# EAGLE schematic Buddy_PCB (EAGLE 7.5.0)
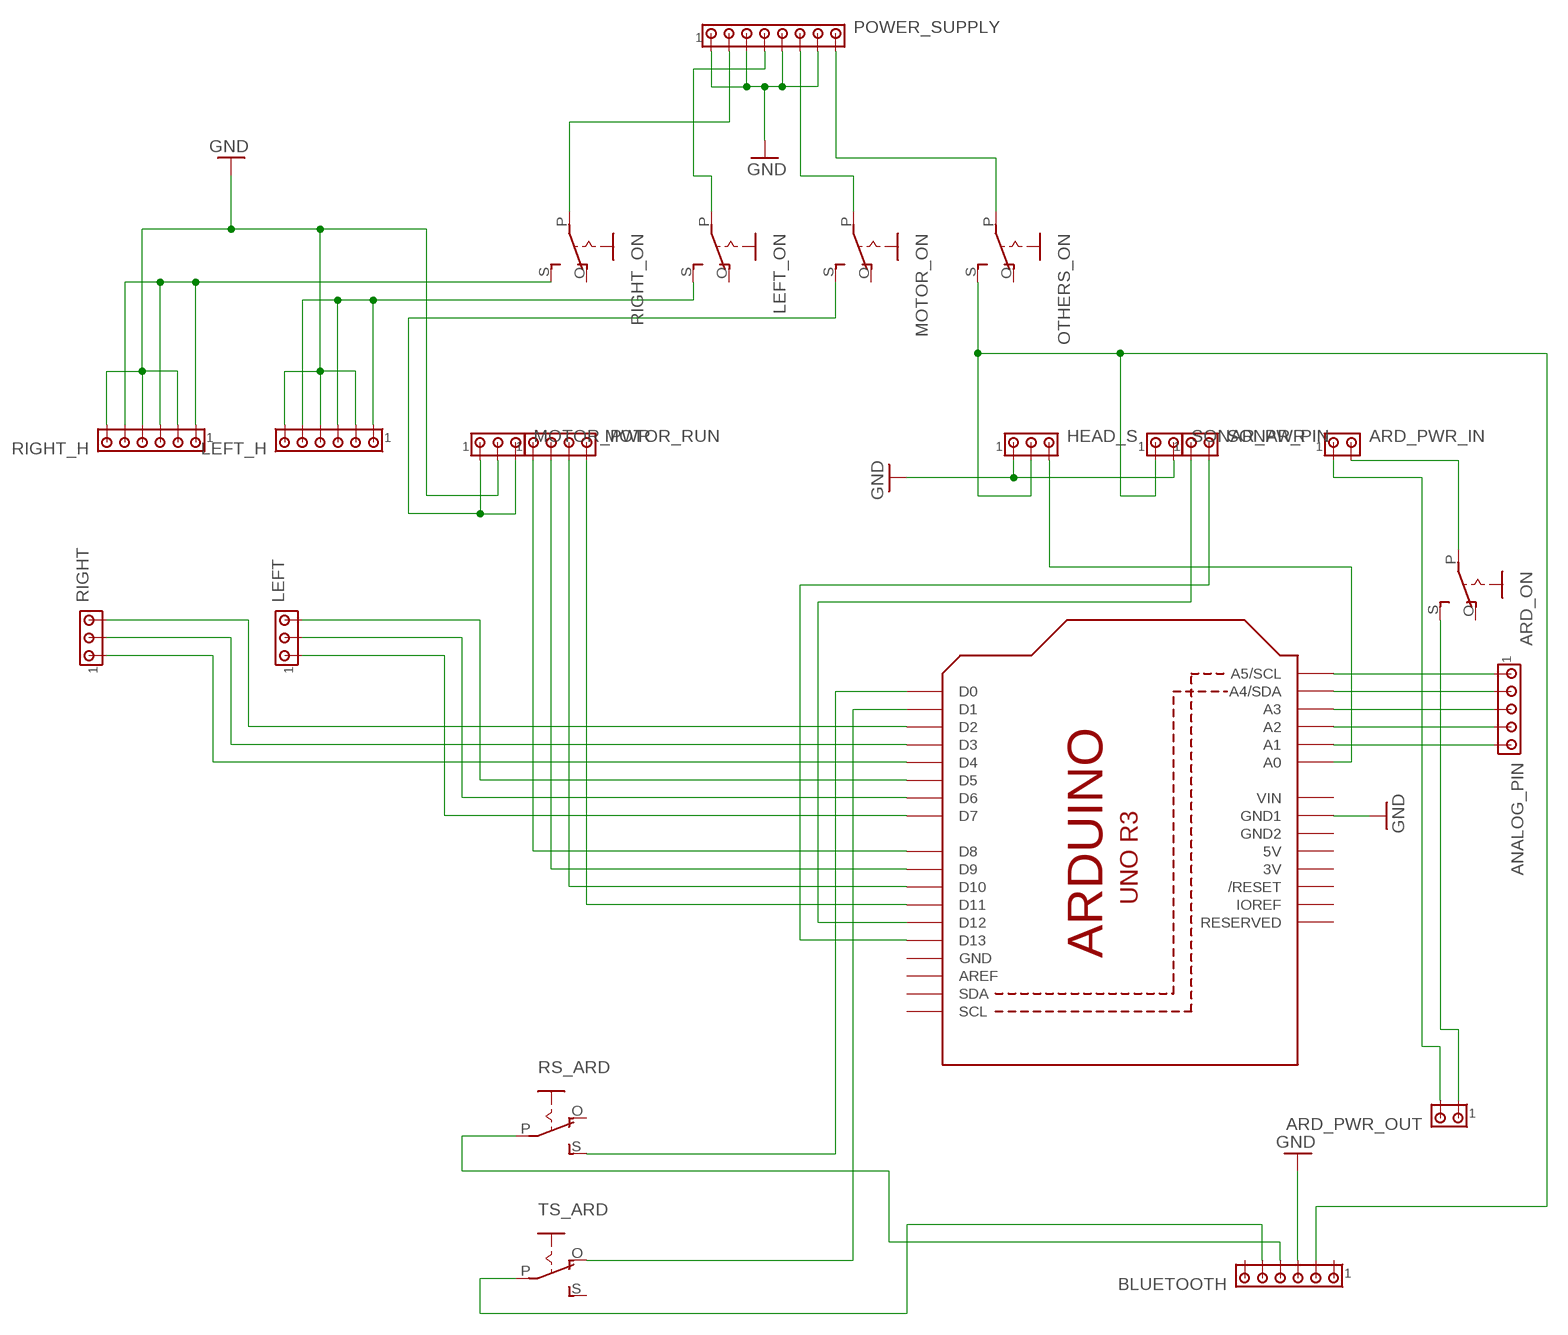
[diagram p0: schematic, sheet 1]

## Parts
ANALOG_PIN  MTA05-100  [10X05MTA]
ARD_ON  EG1218S  [EG1218]
ARD_PWR_IN  MTA02-100  [10X02MTA]
ARD_PWR_OUT  MTA02-100  [10X02MTA]
BLUETOOTH  MTA06-100  [10X06MTA]
HEAD_S  MTA03-100  [10X03MTA]
LEFT  MTA03-100  [10X03MTA]
LEFT_H  MTA06-100  [10X06MTA]
LEFT_ON  EG1218S  [EG1218]
MOTOR_ON  EG1218S  [EG1218]
MOTOR_PWR  MTA03-100  [10X03MTA]
MOTOR_RUN  MTA04-100  [10X04MTA]
OTHERS_ON  EG1218S  [EG1218]
POWER_SUPPLY  MTA08-100  [10X08MTA]
RIGHT  MTA03-100  [10X03MTA]
RIGHT_H  MTA06-100  [10X06MTA]
RIGHT_ON  EG1218S  [EG1218]
RS_ARD  EG1218S  [EG1218]
SONAR_PIN  MTA02-100  [10X02MTA]
SONAR_PWR  MTA02-100  [10X02MTA]
TS_ARD  EG1218S  [EG1218]
UNO  ARDUINOR3-DIMENSION  [ARDUINOR3]

## Nets
GND: BLUETOOTH.3 HEAD_S.1 LEFT_H.2 LEFT_H.4 LEFT_H.6 MOTOR_PWR.2 POWER_SUPPLY.1 POWER_SUPPLY.3 POWER_SUPPLY.5 POWER_SUPPLY.7 RIGHT_H.2 RIGHT_H.4 RIGHT_H.6 SONAR_PWR.2 UNO.GND1
N$1: RS_ARD.S UNO.D0
N$2: TS_ARD.O UNO.D1
N$3: RIGHT.3 UNO.D2
N$4: RIGHT.2 UNO.D3
N$5: RIGHT.1 UNO.D4
N$6: LEFT.3 UNO.D5
N$7: LEFT.2 UNO.D6
N$8: LEFT.1 UNO.D7
N$9: MOTOR_RUN.1 UNO.D8
N$10: MOTOR_RUN.2 UNO.D9
N$11: MOTOR_RUN.3 UNO.D10
N$12: MOTOR_RUN.4 UNO.D11
N$13: SONAR_PIN.1 UNO.D12
N$14: SONAR_PIN.2 UNO.D13
N$15: HEAD_S.3 UNO.A0
N$16: ARD_ON.P ARD_PWR_IN.2
N$17: ARD_ON.S ARD_PWR_OUT.1
N$18: ARD_PWR_IN.1 ARD_PWR_OUT.2
N$19: ANALOG_PIN.4 UNO.A2
N$21: POWER_SUPPLY.2 RIGHT_ON.P
N$22: LEFT_ON.P POWER_SUPPLY.4
N$23: MOTOR_ON.P POWER_SUPPLY.6
N$24: OTHERS_ON.P POWER_SUPPLY.8
N$25: RIGHT_H.1 RIGHT_H.3 RIGHT_H.5 RIGHT_ON.S
N$26: LEFT_H.1 LEFT_H.3 LEFT_H.5 LEFT_ON.S
N$29: MOTOR_ON.S MOTOR_PWR.1 MOTOR_PWR.3
N$31: BLUETOOTH.2 HEAD_S.2 OTHERS_ON.S SONAR_PWR.1
N$34: BLUETOOTH.4 RS_ARD.P
N$35: BLUETOOTH.5 TS_ARD.P
N$36: ANALOG_PIN.1 UNO.A5(A5/SCL)
N$37: ANALOG_PIN.2 UNO.A4(A4/SDA)
N$38: ANALOG_PIN.3 UNO.A3
N$40: ANALOG_PIN.5 UNO.A1
Unconnected: ARD_ON.O BLUETOOTH.1 BLUETOOTH.6 LEFT_ON.O MOTOR_ON.O OTHERS_ON.O RIGHT_ON.O RS_ARD.O TS_ARD.S UNO.AREF UNO.IOREF UNO.RESERVED UNO.RESET(/RESET) UNO.SCL UNO.SDA

## Power pins joined to a net without a drawn wire
3V: UNO.3V
5V: UNO.5V
GND: UNO.GND
GND2: UNO.GND2
VIN: UNO.VIN

## Library data of the parts
ANALOG_PIN = con-amp:MTA05-100: AMP connector
ARD_ON LEFT_ON MOTOR_ON OTHERS_ON RIGHT_ON RS_ARD TS_ARD = adafruit:EG1218: SLIDING SWITCH 0.1" spacing through hole, vertical SPDT slide switch http://www.ladyada.net/library/pcb/eaglelibrary.html
ARD_PWR_IN ARD_PWR_OUT SONAR_PIN SONAR_PWR = con-amp:MTA02-100: AMP connector
BLUETOOTH LEFT_H RIGHT_H = con-amp:MTA06-100: AMP connector Connection corrected 2014-09-19
HEAD_S LEFT MOTOR_PWR RIGHT = con-amp:MTA03-100: AMP connector
MOTOR_RUN = con-amp:MTA04-100: AMP connector
POWER_SUPPLY = con-amp:MTA08-100: AMP connector
UNO = adafruit:ARDUINOR3: This is a new object for the new Arduino R3 - with extra pins that you may want to use (such as IOref, and duplicated A4/A5